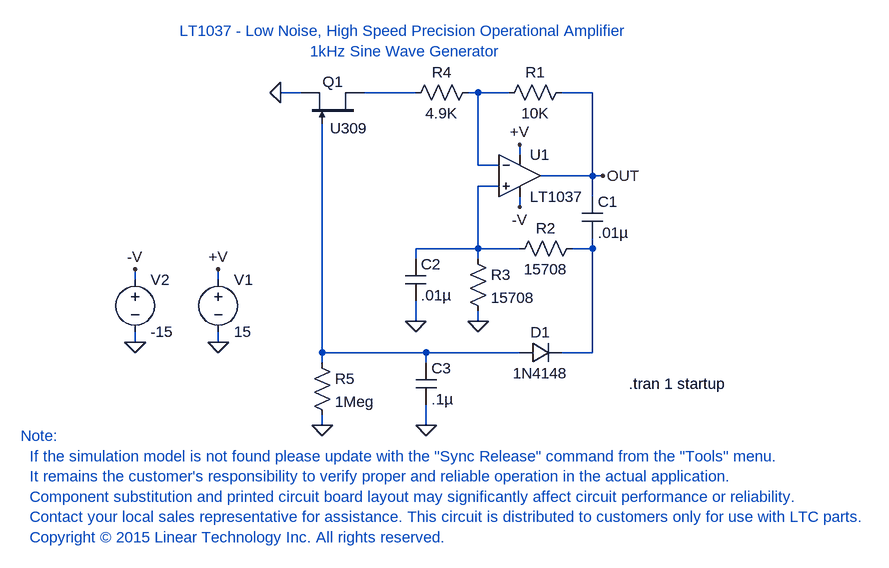
[diagram p0: schematic LT1037_TA01.asc]
LT1037_TA01.asc, the LTspice schematic file:
Version 4
SHEET 1 1184 964
WIRE -80 112 -112 112
WIRE 96 112 16 112
WIRE 192 112 176 112
WIRE 240 112 192 112
WIRE 368 112 320 112
WIRE 256 208 256 192
WIRE 192 224 192 112
WIRE 224 224 192 224
WIRE 368 240 368 112
WIRE 368 240 288 240
WIRE 384 240 368 240
WIRE 224 256 192 256
WIRE 368 272 368 240
WIRE 256 288 256 272
WIRE 192 352 192 256
WIRE 192 352 96 352
WIRE 256 352 192 352
WIRE 368 352 368 336
WIRE 368 352 336 352
WIRE 96 368 96 352
WIRE 192 368 192 352
WIRE -336 400 -336 384
WIRE -208 400 -208 384
WIRE 96 464 96 432
WIRE 192 464 192 448
WIRE -336 496 -336 480
WIRE -208 496 -208 480
WIRE -48 512 -48 160
WIRE 112 512 -48 512
WIRE 256 512 112 512
WIRE 368 512 368 352
WIRE 368 512 320 512
WIRE -48 528 -48 512
WIRE 112 528 112 512
WIRE -48 624 -48 608
WIRE 112 624 112 592
FLAG -208 496 0
FLAG 256 192 +V
FLAG -208 384 +V
FLAG 256 288 -V
FLAG -336 496 0
FLAG -336 384 -V
FLAG 384 240 OUT
FLAG 96 464 0
FLAG 192 464 0
FLAG -112 112 0
FLAG -48 624 0
FLAG 112 624 0
SYMBOL voltage -208 384 R0
SYMATTR InstName V1
SYMATTR Value 15
SYMBOL voltage -336 384 R0
SYMATTR InstName V2
SYMATTR Value -15
SYMBOL res 336 96 R90
WINDOW 0 0 56 VBottom 2
WINDOW 3 32 56 VTop 2
SYMATTR InstName R1
SYMATTR Value 10K
SYMBOL LT1037 256 176 R0
SYMATTR InstName U1
SYMBOL cap 352 272 R0
SYMATTR InstName C1
SYMATTR Value .01µ
SYMBOL res 352 336 R90
WINDOW 0 0 56 VBottom 2
WINDOW 3 32 56 VTop 2
SYMATTR InstName R2
SYMATTR Value 15708
SYMBOL cap 80 368 R0
SYMATTR InstName C2
SYMATTR Value .01µ
SYMBOL res 176 352 R0
SYMATTR InstName R3
SYMATTR Value 15708
SYMBOL res 192 96 R90
WINDOW 0 0 56 VBottom 2
WINDOW 3 32 56 VTop 2
SYMATTR InstName R4
SYMATTR Value 4.9K
SYMBOL njf 16 160 M270
WINDOW 0 49 47 VTop 2
WINDOW 3 -7 52 VLeft 2
SYMATTR InstName Q1
SYMATTR Value U309
SYMBOL diode 256 528 R270
WINDOW 0 32 32 VTop 2
WINDOW 3 0 32 VBottom 2
SYMATTR InstName D1
SYMATTR Value 1N4148
SYMBOL res -64 512 R0
SYMATTR InstName R5
SYMATTR Value 1Meg
SYMBOL cap 96 528 R0
SYMATTR InstName C3
SYMATTR Value .1µ
TEXT 80 64 Bottom 2 ;LT1037 - Low Noise, High Speed Precision Operational Amplifier\n1kHz Sine Wave Generator
TEXT -512 640 Left 2 ;Note:\n  If the simulation model is not found please update with the "Sync Release" command from the "Tools" menu.\n  It remains the customer's responsibility to verify proper and reliable operation in the actual application.\n  Component substitution and printed circuit board layout may significantly affect circuit performance or reliability.\n  Contact your local sales representative for assistance. This circuit is distributed to customers only for use with LTC parts.\n  Copyright © 2015 Linear Technology Inc. All rights reserved.
TEXT 424 560 Left 2 !.tran 1 startup

The netlist it stands for:
* LT1037_TA01.asc
V1 +V 0 15
V2 -V 0 -15
R1 OUT N002 10K
* U1: LT1037 (symbol LT1037 not available, pins judged from their places): In+=N003 In-=N002 V+=+V V-=-V OUT=OUT
C1 OUT N004 .01µ
R2 N004 N003 15708
C2 N003 0 .01µ
R3 N003 0 15708
R4 N002 N001 4.9K
J§Q1 N001 N005 0 U309
D1 N005 N004 1N4148
R5 N005 0 1Meg
C3 N005 0 .1µ
.model D D
.lib standard.dio
.model NJF NJF
.model PJF PJF
.lib standard.jft
* LT1037 - Low Noise, High Speed Precision Operational Amplifier
* 1kHz Sine Wave Generator
* Note:
*   If the simulation model is not found please update with the "Sync Release" command from the "Tools" menu.
*   It remains the customer's responsibility to verify proper and reliable operation in the actual application.
*   Component substitution and printed circuit board layout may significantly affect circuit performance or reliability.
*   Contact your local sales representative for assistance. This circuit is distributed to customers only for use with LTC parts.
*   Copyright © 2015 Linear Technology Inc. All rights reserved.
.tran 1 startup
.backanno
.end